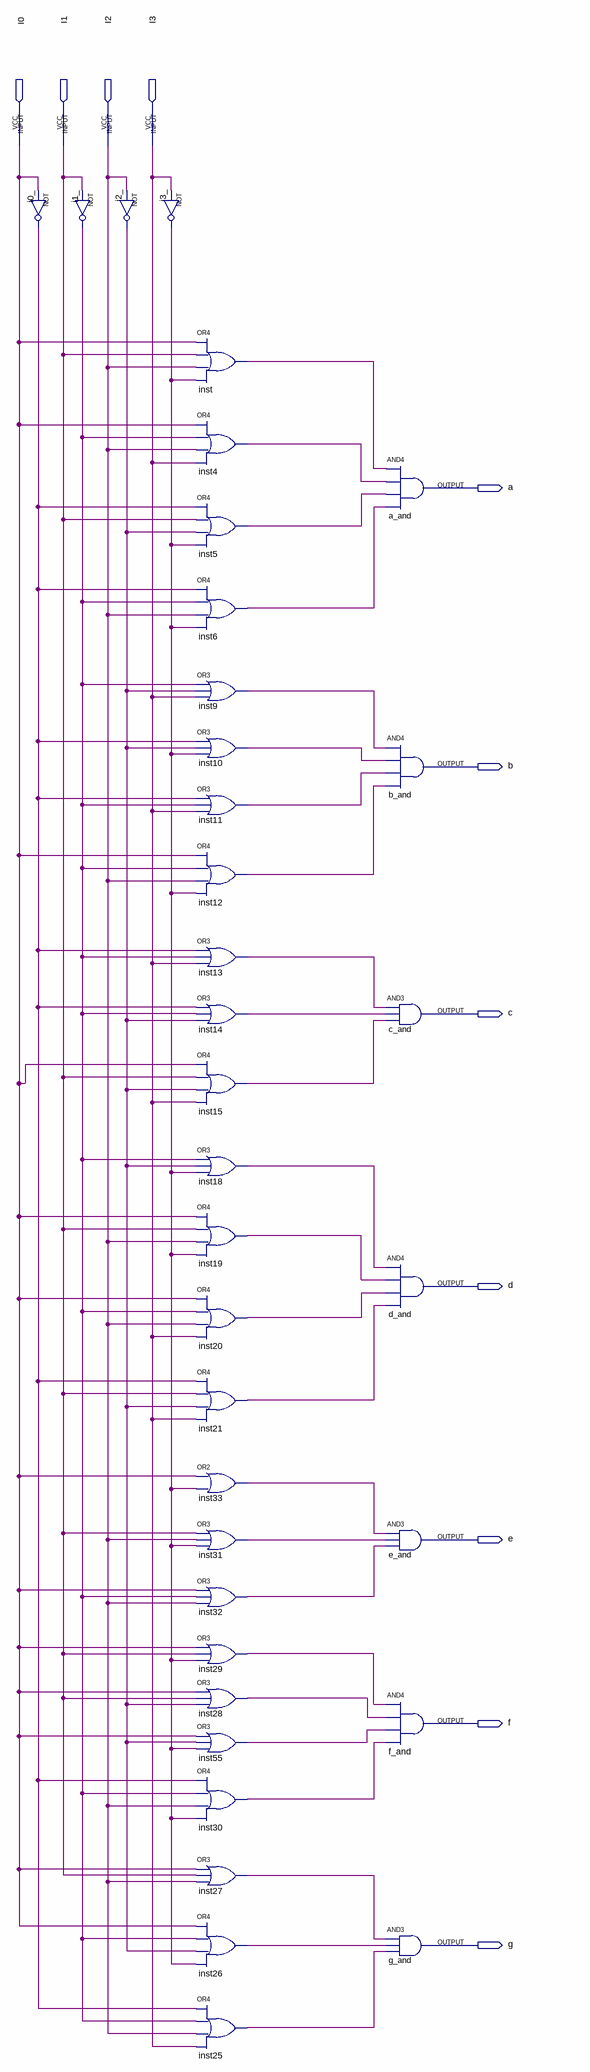
[diagram p0: schematic sheet]
// Quartus schematic decod7segment.bdf as structural Verilog: 36 symbols, 11 pins
module decod7segment (
  input  I0,
  input  I1,
  input  I2,
  input  I3,
  output a,
  output b,
  output c,
  output d,
  output e,
  output f,
  output g
);

  wire i0__out, i1__out, i2__out, i3__out, inst4_out, inst5_out, inst6_out, inst9_out, inst10_out,
       inst11_out, inst12_out, inst13_out, inst14_out, inst15_out, inst18_out, inst19_out, inst20_out,
       inst21_out, inst25_out, inst26_out, inst27_out, inst28_out, inst29_out, inst30_out, inst31_out,
       inst32_out, inst33_out, inst55_out, inst_out;

  not i0_ (i0__out, I0);
  not i1_ (i1__out, I1);
  not i2_ (i2__out, I2);
  not i3_ (i3__out, I3);
  or inst (inst_out, I0, I1, I2, i3__out);
  or inst4 (inst4_out, I0, i1__out, I2, I3);
  or inst5 (inst5_out, i0__out, I1, i2__out, i3__out);
  or inst6 (inst6_out, i0__out, i1__out, I2, i3__out);
  or inst9 (inst9_out, i1__out, i2__out, I3);
  or inst10 (inst10_out, i0__out, i2__out, i3__out);
  or inst11 (inst11_out, i0__out, i1__out, I3);
  or inst12 (inst12_out, I0, i1__out, I2, i3__out);
  or inst13 (inst13_out, i0__out, i1__out, I3);
  or inst14 (inst14_out, i0__out, i1__out, i2__out);
  or inst15 (inst15_out, I0, I1, i2__out, I3);
  or inst18 (inst18_out, i1__out, i2__out, i3__out);
  or inst19 (inst19_out, I0, I1, I2, i3__out);
  or inst20 (inst20_out, I0, i1__out, I2, I3);
  or inst21 (inst21_out, i0__out, I1, i2__out, I3);
  or inst33 (inst33_out, I0, i3__out);
  or inst31 (inst31_out, I1, I2, i3__out);
  or inst32 (inst32_out, I0, i1__out, I2);
  or inst29 (inst29_out, I0, I1, i3__out);
  or inst28 (inst28_out, I0, I1, i2__out);
  or inst55 (inst55_out, I0, i2__out, i3__out);
  or inst30 (inst30_out, i0__out, i1__out, I2, i3__out);
  or inst27 (inst27_out, I0, I1, I2);
  or inst26 (inst26_out, I0, i1__out, i2__out, i3__out);
  or inst25 (inst25_out, i0__out, i1__out, I2, I3);
  and a_and (a, inst_out, inst4_out, inst5_out, inst6_out);
  and b_and (b, inst9_out, inst10_out, inst11_out, inst12_out);
  and c_and (c, inst13_out, inst14_out, inst15_out);
  and d_and (d, inst18_out, inst19_out, inst20_out, inst21_out);
  and e_and (e, inst33_out, inst31_out, inst32_out);
  and f_and (f, inst29_out, inst28_out, inst55_out, inst30_out);
  and g_and (g, inst27_out, inst26_out, inst25_out);
endmodule
